# Altium project DC_DC.PrjPcb
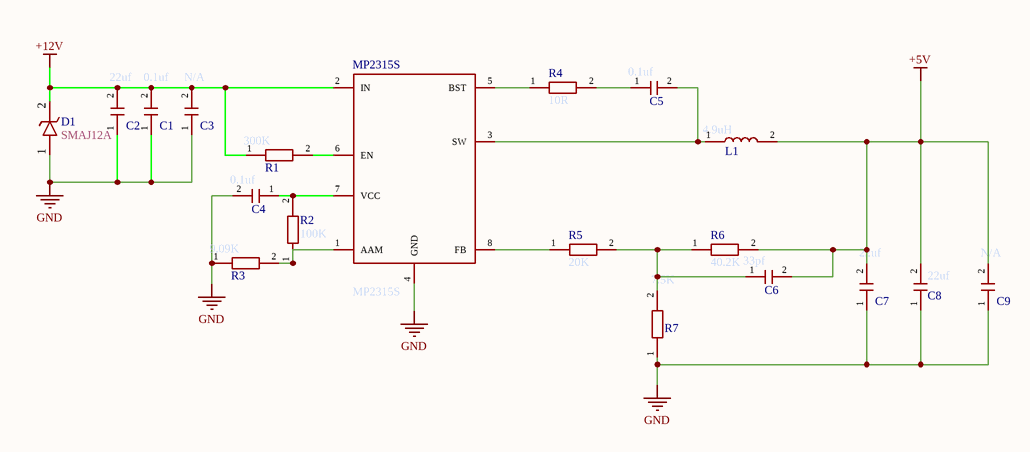
[diagram p0: Sheet1.SchDoc]
1 sheet, 19 parts. Net scope: global (net labels, ports and power ports of the same name join across sheets).
Board file: PCB1.PcbDoc

## Sheet Sheet1.SchDoc
size A4; SheetNumber: 1; SheetTotal: 1

### Parts
C1  0.1uf  [0603C]
C2  22uf  [1206C]
C3  N/A  [1206C]
C4  0.1uf  [0603C]
C5  0.1uf  [0603C]
C6  33pf  [0603C]
C7  22uf  [0805c]
C8  22uf  [0805c]
C9  N/A  [0805c]
D1  SMAJ12A  [SMA]
L1  4.9uH  [L_pcb]
MP2315S  MP2315S  [MP2315_PCB]
R1  300K  [0603R]
R2  100K  [0603R]
R3  9.09K  [0603R]
R4  10R  [0603R]
R5  20K  [0603R]
R6  40.2K  [0603R]
R7  7.5K  [0603R]

### Nets
+5V: C6.2 C7.2 C8.2 C9.2 L1.2 R6.2
+12V: C1.2 C2.2 C3.2 D1.2 MP2315S.2(IN) R1.1
GND: C1.1 C2.1 C3.1 C4.2 C7.1 C8.1 C9.1 D1.1 MP2315S.4(GND) R3.1 R7.1
NetC4_1: C4.1 MP2315S.7(VCC) R2.2
NetC5_1: C5.1 R4.2
NetC5_2: C5.2 L1.1 MP2315S.3(SW)
NetC6_1: C6.1 R5.2 R6.1 R7.2
NetMP2315S_1: MP2315S.1(AAM) R2.1 R3.2
NetMP2315S_5: MP2315S.5(BST) R4.1
NetMP2315S_6: MP2315S.6(EN) R1.2
NetMP2315S_8: MP2315S.8(FB) R5.1

### Library data of the parts
C1-C9 = capacitor
D1 = D
L1 = inductance
R1-R7 = resistance